# EAGLE design Joystickv05 (EAGLE 7.3.0)
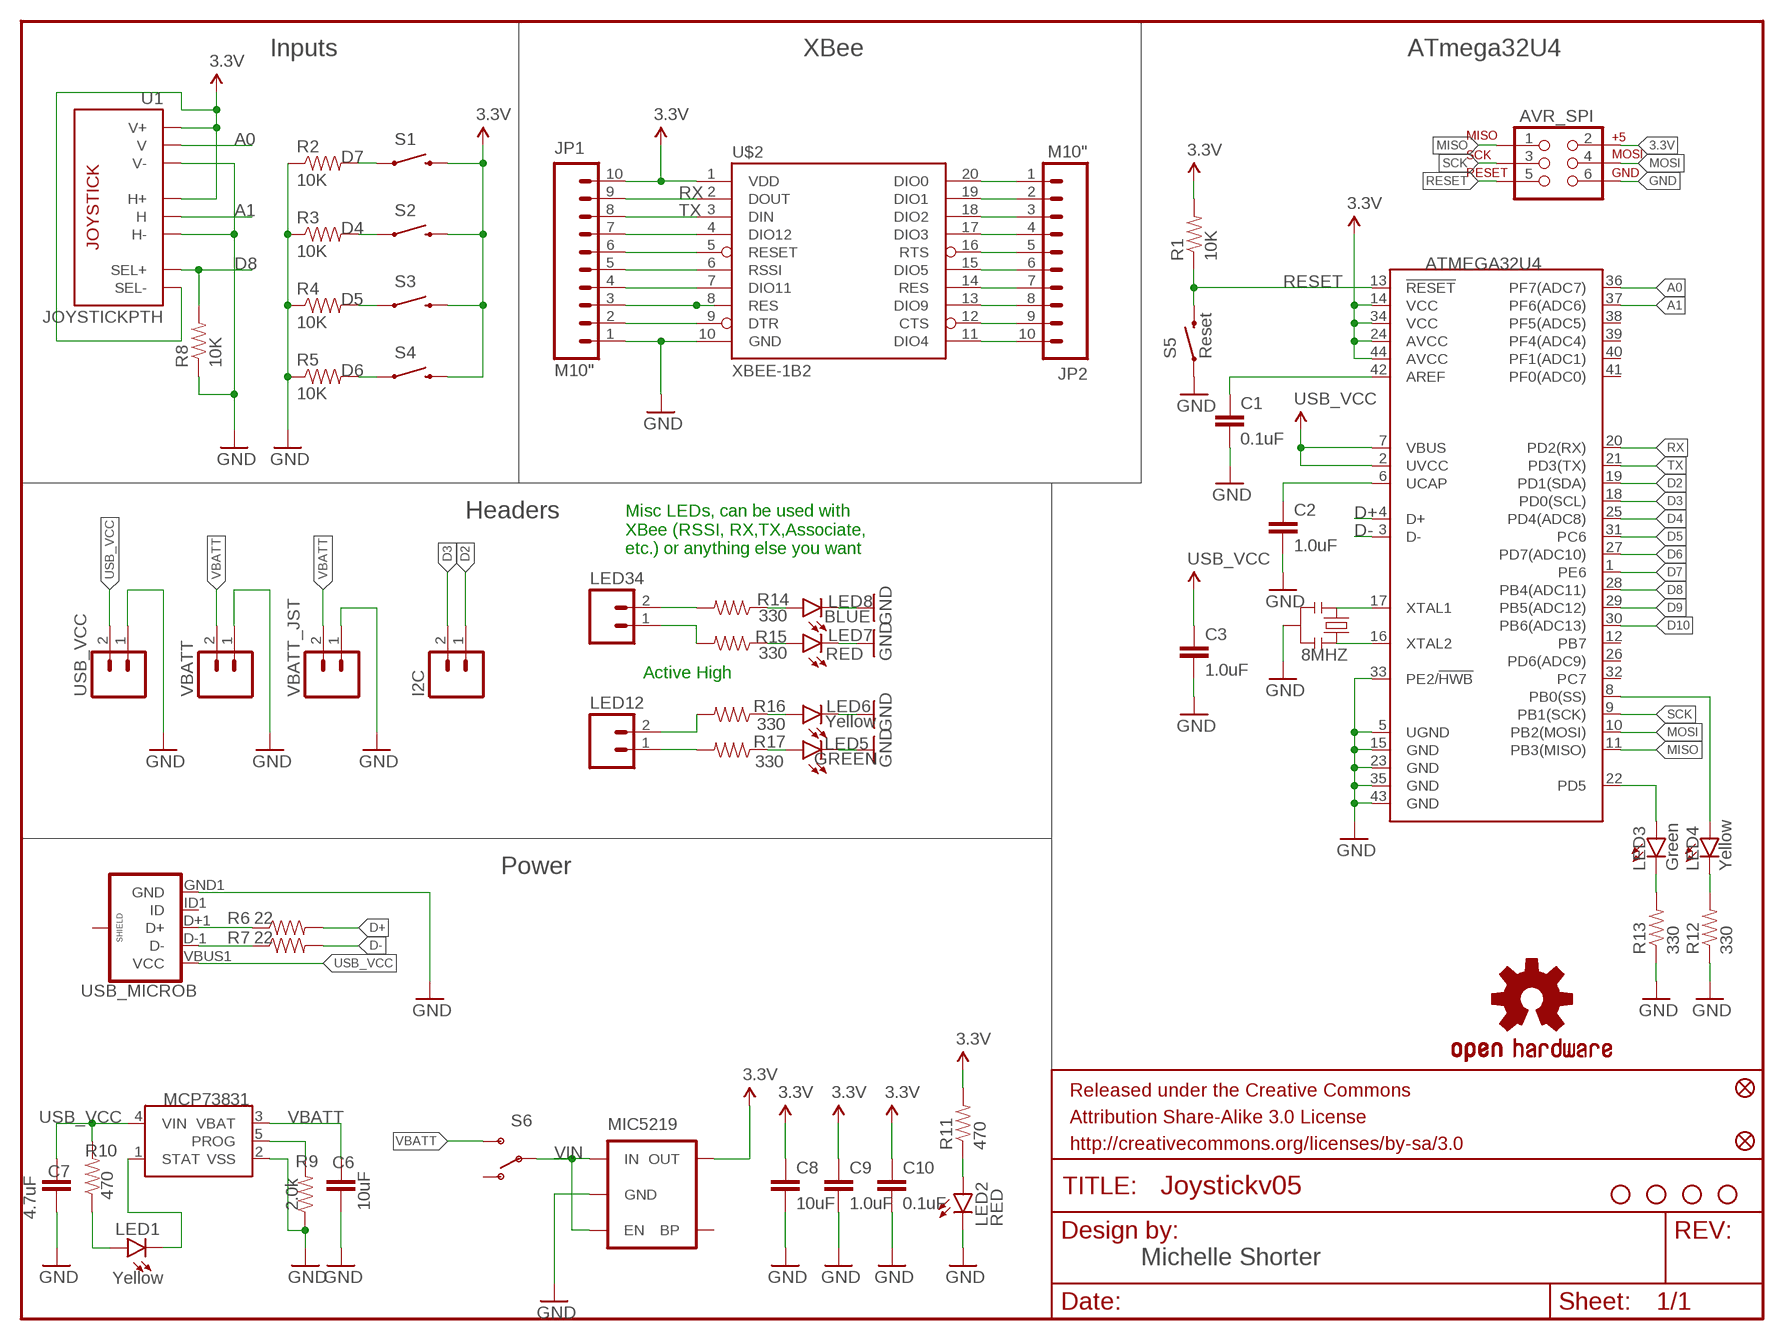
[diagram p0: schematic, sheet 1]

## Parts
ATMEGA32U4  ATMEGA32U41:1-LESS_PASTE  [QFN-44-NOPAD_1:1-LESS_PASTE]
AVR_SPI  AVR_SPI_PRG_6PTH  [2X3]
C1  0.1uF  0.1UF-25V(+80/-20%)(0603)  [0603-CAP]
C2  1.0uF  1.0UF-16V-10%(0603)  [0603-CAP]
C3  1.0uF  1.0UF-16V-10%(0603)  [0603-CAP]
C6  10uF  10UF-6.3V-20%(0603)  [0603-CAP]
C7  4.7uF  4.7UF-6.3V-10%(0603)0603  [0603-CAP]
C8  10uF  10UF-6.3V-20%(0603)  [0603-CAP]
C9  1.0uF  1.0UF-16V-10%(0603)  [0603-CAP]
C10  0.1uF  0.1UF-25V(+80/-20%)(0603)  [0603-CAP]
FID1  FIDUCIALUFIDUCIAL  [MICRO-FIDUCIAL]
FID2  FIDUCIALUFIDUCIAL  [MICRO-FIDUCIAL]
I2C  M02PTH  [1X02]
JP1  M10"  [1X10]
JP2  M10"  [1X10]
LED1  Yellow  LED-YELLOW0603  [LED-0603]
LED2  RED  LED-RED0603  [LED-0603]
LED3  Green  LED-GREEN0603  [LED-0603]
LED4  Yellow  LED-YELLOW0603  [LED-0603]
LED5  GREEN  LED-GREEN0603  [LED-0603]
LED6  Yellow  LED-YELLOW0603  [LED-0603]
LED7  RED  LED-RED0603  [LED-0603]
LED8  BLUE  LED-BLUE0603  [LED-0603]
LED12  M02PTH  [1X02]
LED34  M02PTH  [1X02]
LOGO1  OSHW-LOGOM  [OSHW-LOGO-M]
MIC5219  V_REG_MIC5219SMD  [SOT23-5]
R1  10K  10KOHM-1/10W-1%(0603)0603  [0603-RES]
R2  10K  10KOHM-1/10W-1%(0603)0603  [0603-RES]
R3  10K  10KOHM-1/10W-1%(0603)0603  [0603-RES]
R4  10K  10KOHM-1/10W-1%(0603)0603  [0603-RES]
R5  10K  10KOHM-1/10W-1%(0603)0603  [0603-RES]
R6  22  22OHM1/10W1%(0603)  [0603-RES]
R7  22  22OHM1/10W1%(0603)  [0603-RES]
R8  10K  10KOHM-1/10W-1%(0603)0603  [0603-RES]
R9  2.0k  2.0KOHM1/10W5%(0603)  [0603-RES]
R10  470  470OHM1/10W1%(0603)  [0603-RES]
R11  470  470OHM1/10W1%(0603)  [0603-RES]
R12  330  330OHM1/10W1%(0603)  [0603-RES]
R13  330  330OHM1/10W1%(0603)  [0603-RES]
R14  330  330OHM1/10W1%(0603)  [0603-RES]
R15  330  330OHM1/10W1%(0603)  [0603-RES]
R16  330  330OHM1/10W1%(0603)  [0603-RES]
R17  330  330OHM1/10W1%(0603)  [0603-RES]
S1  SWITCH-MOMENTARY-212MM  [TACTILE-PTH-12MM]
S2  SWITCH-MOMENTARY-212MM  [TACTILE-PTH-12MM]
S3  SWITCH-MOMENTARY-212MM  [TACTILE-PTH-12MM]
S4  SWITCH-MOMENTARY-212MM  [TACTILE-PTH-12MM]
S5  Reset  SWITCH-MOMENTARY-2SMD  [TACTILE-SWITCH-SMD]
S6  SWITCH-SPDTPTH  [SWITCH-SPDT]
STANDOFF1  STAND-OFF  [STAND-OFF]
STANDOFF2  STAND-OFF  [STAND-OFF]
STANDOFF3  STAND-OFF  [STAND-OFF]
STANDOFF4  STAND-OFF  [STAND-OFF]
U1  JOYSTICKPTH  [JOYSTICK]
U4  MCP73831  [SOT23-5]
U$2  XBEE-1B2  [XBEE-SILK]
U$3  8MHZ  RESONATOR8MHZ  [RESONATOR-SMD]
USB_MICROB  USB_MICROB_PLUGCONN-11752  [USB-B-MICRO-SMD_V03]
USB_VCC  M02PTH  [1X02]
VBATT  M02PTH  [1X02]
VBATT_JST  M02-JST-2MM-SMT  [JST-2-SMD]

## Nets
3.3V: ATMEGA32U4.14(VCC) ATMEGA32U4.24(AVCC) ATMEGA32U4.34(VCC) ATMEGA32U4.44(AVCC) AVR_SPI.2 C8.1 C9.1 C10.1 JP1.10 MIC5219.5(OUT) R1.2 R11.2 S1.3 S2.3 S3.3 S4.3 U1.B2A(SEL-) U1.H1(H+) U1.V1(V+) U$2.1(VDD)
A0: ATMEGA32U4.36(PF7(ADC7)) U1.V2(V)
A1: ATMEGA32U4.37(PF6(ADC6)) U1.H2(H)
D2: ATMEGA32U4.19(PD1(SDA)) I2C.1
D3: ATMEGA32U4.18(PD0(SCL)) I2C.2
D4: ATMEGA32U4.25(PD4(ADC8)) R3.2 S2.1
D5: ATMEGA32U4.31(PC6) R4.2 S3.1
D6: ATMEGA32U4.27(PD7(ADC10)) R5.2 S4.1
D7: ATMEGA32U4.1(PE6) R2.2 S1.1
D8: ATMEGA32U4.28(PB4(ADC11)) R8.2 U1.B1A(SEL+)
D9: ATMEGA32U4.29(PB5(ADC12))
D10: ATMEGA32U4.30(PB6(ADC13))
D+: ATMEGA32U4.4(D+) R6.2
D-: ATMEGA32U4.3(D-) R7.2
GND: ATMEGA32U4.5(UGND) ATMEGA32U4.15(GND) ATMEGA32U4.23(GND) ATMEGA32U4.33(PE2/!HWB) ATMEGA32U4.35(GND) ATMEGA32U4.43(GND) AVR_SPI.6 C1.2 C2.2 C3.2 C6.2 C7.2 C8.2 C9.2 C10.2 JP1.1 LED2.C LED5.C LED6.C LED7.C LED8.C MIC5219.2(GND) R2.1 R3.1 R4.1 R5.1 R8.1 R9.1 R12.1 R13.1 S5.1 U1.H3(H-) U1.V3(V-) U4.2(VSS) U$2.10(GND) U$3.2 USB_MICROB.GND1(GND) USB_VCC.1 VBATT.1 VBATT_JST.1
MISO: ATMEGA32U4.11(PB3(MISO)) AVR_SPI.1
MOSI: ATMEGA32U4.10(PB2(MOSI)) AVR_SPI.4
N$1: ATMEGA32U4.17(XTAL1) U$3.1
N$2: ATMEGA32U4.42(AREF) C1.1
N$3: R6.1 USB_MICROB.D+1(D+)
N$4: JP1.2 U$2.9(DTR)
N$5: ATMEGA32U4.6(UCAP) C2.1
N$6: ATMEGA32U4.16(XTAL2) U$3.3
N$8: JP1.3 U$2.8(RES)
N$9: R7.1 USB_MICROB.D-1(D-)
N$10: JP1.4 U$2.7(DIO11)
N$11: R9.2 U4.5(PROG)
N$12: JP1.5 U$2.6(RSSI)
N$13: JP1.6 U$2.5(RESET)
N$14: JP1.7 U$2.4(DIO12)
N$15: JP2.10 U$2.11(DIO4)
N$16: JP2.9 U$2.12(CTS)
N$17: JP2.8 U$2.13(DIO9)
N$18: JP2.7 U$2.14(RES)
N$19: JP2.6 U$2.15(DIO5)
N$20: JP2.5 U$2.16(RTS)
N$21: JP2.4 U$2.17(DIO3)
N$23: JP2.3 U$2.18(DIO2)
N$24: JP2.2 U$2.19(DIO1)
N$25: JP2.1 U$2.20(DIO0)
N$26: LED2.A R11.1
N$27: LED1.A R10.1
N$28: LED1.C U4.1(STAT)
N$29: ATMEGA32U4.8(PB0(SS)) LED4.A
N$30: LED4.C R12.2
N$31: LED3.C R13.2
N$32: ATMEGA32U4.22(PD5) LED3.A
N$33: LED12.1 R17.2
N$34: LED8.A R14.1
N$35: LED7.A R15.1
N$36: LED6.A R16.1
N$37: LED5.A R17.1
N$38: LED12.2 R16.2
N$39: LED34.1 R15.2
N$40: LED34.2 R14.2
RESET: ATMEGA32U4.13(!RESET) AVR_SPI.5 R1.1 S5.3
RX: ATMEGA32U4.20(PD2(RX)) JP1.9 U$2.2(DOUT)
SCK: ATMEGA32U4.9(PB1(SCK)) AVR_SPI.3
TX: ATMEGA32U4.21(PD3(TX)) JP1.8 U$2.3(DIN)
USB_VCC: ATMEGA32U4.2(UVCC) ATMEGA32U4.7(VBUS) C3.1 C7.1 R10.2 U4.4(VIN) USB_MICROB.VBUS1(VCC) USB_VCC.2
VBATT: C6.1 S6.3(S) U4.3(VBAT) VBATT.2 VBATT_JST.2
VIN: MIC5219.1(IN) MIC5219.3(EN) S6.2(P)
Unconnected: ATMEGA32U4.12(PB7) ATMEGA32U4.26(PD6(ADC9)) ATMEGA32U4.32(PC7) ATMEGA32U4.38(PF5(ADC5)) ATMEGA32U4.39(PF4(ADC4)) ATMEGA32U4.40(PF1(ADC1)) ATMEGA32U4.41(PF0(ADC0)) MIC5219.4(BP) S6.1(O) USB_MICROB.ID1(ID) USB_MICROB.SHIELD1(SHIELD) USB_MICROB.SHIELD2(SHIELD) USB_MICROB.SHIELD3(SHIELD)

## Notes on the sheet
- Inputs | XBee | ATmega32U4
- Headers
- Misc LEDs, can be used with
  XBee (RSSI, RX,TX,Associate,
  etc.) or anything else you want
- Active High
- Power
- Michelle Shorter

## Library data of the parts
ATMEGA32U4 = SparkFun-DigitalIC:ATMEGA32U4: Atmel 44-pin 8-bit Microcontroller with 32KBytes of ISP Flash and USB Controller
AVR_SPI = SparkFun-Connectors:AVR_SPI_PRG_6: AVR ISP 6 Pin This is the reduced ISP connector for AVR programming. Common on Arduino. This footprint will take up less PCB space and can be used with a 10-pin to 6-pin adapter such as SKU: BOB-08508
C1 C10 = SparkFun-Capacitors:0.1UF-25V(+80/-20%)(0603): CAP-00810 Ceramic Standard decoupling cap; PROD_ID: CAP-00810
C2 C3 C9 = SparkFun-Capacitors:1.0UF-16V-10%(0603): CAP-00868; PROD_ID: CAP-00868
C6 C8 = SparkFun-Capacitors:10UF-6.3V-20%(0603): CAP-11015; PROD_ID: CAP-11015
C7 = SparkFun-Capacitors:4.7UF-6.3V-10%(0603): CAP-08280; PROD_ID: CAP-08280
FID1 FID2 = SparkFun-Aesthetics:FIDUCIAL: Fiducial Alignment Points Various fiducial points for machine vision alignment.
I2C LED12 LED34 USB_VCC VBATT VBATT_JST = SparkFun-Connectors:M02: Header 2 Standard 2-pin 0.1" header. Use with straight break away headers (SKU : PRT-00116), right angle break away headers (PRT-00553), swiss pins (PRT-00743), machine pins (PRT-00117), and female headers (PRT-00115). Molex polarized connector foot print use with SKU : PRT-08233 with associated crimp pins and housings.
JP1 JP2 = SparkFun-Connectors:M10: Header 10 Standard 10-pin 0.1" header. Use with straight break away headers (SKU : PRT-00116), right angle break away headers (PRT-00553), swiss pins (PRT-00743), machine pins (PRT-00117), and female headers (PRT-00115).
LED1 LED4 LED6 = SparkFun-LED:LED-YELLOW: Yellow SMD LEDs LilyPad 1206- DIO-09909 0603- DIO-09003; PROD_ID: DIO-09003
LED2 LED7 = SparkFun-LED:LED-RED: Assorted Red LEDs LilyPad 1206- DIO-09912 1206- DIO-00809 0603- DIO-00819; PROD_ID: DIO-00819
LED3 = SparkFun-LED:LED-GREEN: Various green LEDs Green LEDs used in SFE Production 0603- DIO-00821 LARGE- DIO-00862 LILYPAD- DIO-09910; PROD_ID: DIO-00821; VALUE: GREEN
LED5 = SparkFun-LED:LED-GREEN: Various green LEDs Green LEDs used in SFE Production 0603- DIO-00821 LARGE- DIO-00862 LILYPAD- DIO-09910; PROD_ID: DIO-00821
LED8 = SparkFun-LED:LED-BLUE: Blue LEDs for production use Various blue LEDs stocked by SparkFun production 0603 - DIO-08575 Rebel - DIO-09553 1206 - DIO-09911; PROD_ID: DIO-08575
LOGO1 = SparkFun-Aesthetics:OSHW-LOGO: Open Source Hardware Logo This logo indicates the piece of hardware it is found on incorporates a OSHW license and/or adheres to the definition of open source hardware found here: http://freedomdefined.org/OSHW
MIC5219 = SparkFun-PowerIC:V_REG_MIC5219: V_REG MIC5219 Standard 500mA LDO voltage regulator in SOT-23 layout. Micrel part MIC5219. BP (by-pass) pin is used to lower output noise with 470pF cap, may be left open.
R1-R5 R8 = SparkFun-Resistors:10KOHM-1/10W-1%(0603): RES-00824; PROD_ID: RES-00824
R6 R7 = SparkFun-Resistors:22OHM1/10W1%(0603): RES-08698; PROD_ID: RES-08698
R9 = SparkFun-Resistors:2.0KOHM1/10W5%(0603): RES-08296; PROD_ID: RES-08296
R10 R11 = SparkFun-Resistors:470OHM1/10W1%(0603): RES-07869; PROD_ID: RES-07869
R12-R17 = SparkFun-Resistors:330OHM1/10W1%(0603): RES-00818; PROD_ID: RES-00818
S1-S4 = SparkFun-Electromechanical:SWITCH-MOMENTARY-2: Various NO switches- pushbuttons, reed, etc; PROD_ID: SWCH-09185
S5 = SparkFun-Electromechanical:SWITCH-MOMENTARY-2: Various NO switches- pushbuttons, reed, etc; PROD_ID: SWCH-08247
S6 = SparkFun-Electromechanical:SWITCH-SPDT: SPDT Switch Simple slide switch, Spark Fun Electronics SKU : COM-00102 DPDT SMT slide switch, AYZ0202, SWCH-08179; PROD_ID: SWCH-08261
STANDOFF1-STANDOFF4 = SparkFun-Electromechanical:STAND-OFF: #4 Stand Off This is the mechanical footprint for a #4 phillips button head screw. Use the keepout ring to avoid running the screw head into surrounding components. SKU : PRT-00447
U1 = SparkFun-Electromechanical:JOYSTICK: Thumb Joystick Joystick commonly found in PS2 controllers. Two pots and a select switch. Footprint proven. Spark Fun Electronics SKU : COM-09032
U4 = SparkFun-PowerIC:MCP73831: Miniature single cell, fully integrated Li-Ion, Li-polymer charge management controller http://ww1.microchip.com/downloads/en/DeviceDoc/21984a.pdf IC-09995; PROD_ID: IC-09995
U$2 = SparkFun-RF:XBEE-1: Xbee module footprints
U$3 = SparkFun-FreqCtrl:RESONATOR: Resonator Small SMD resonator. Used, eg, on the Arduino Pro/ Pro Mini boards. 8MHz- XTAL-08895 16MHz- XTAL-08900; PROD_ID: XTAL-08895
USB_MICROB = SparkFun-Connectors:USB_MICROB_PLUG: USB Micro-B connectors Some male, some female. Watch your step!; PROD_ID: CONN-11752

## Board
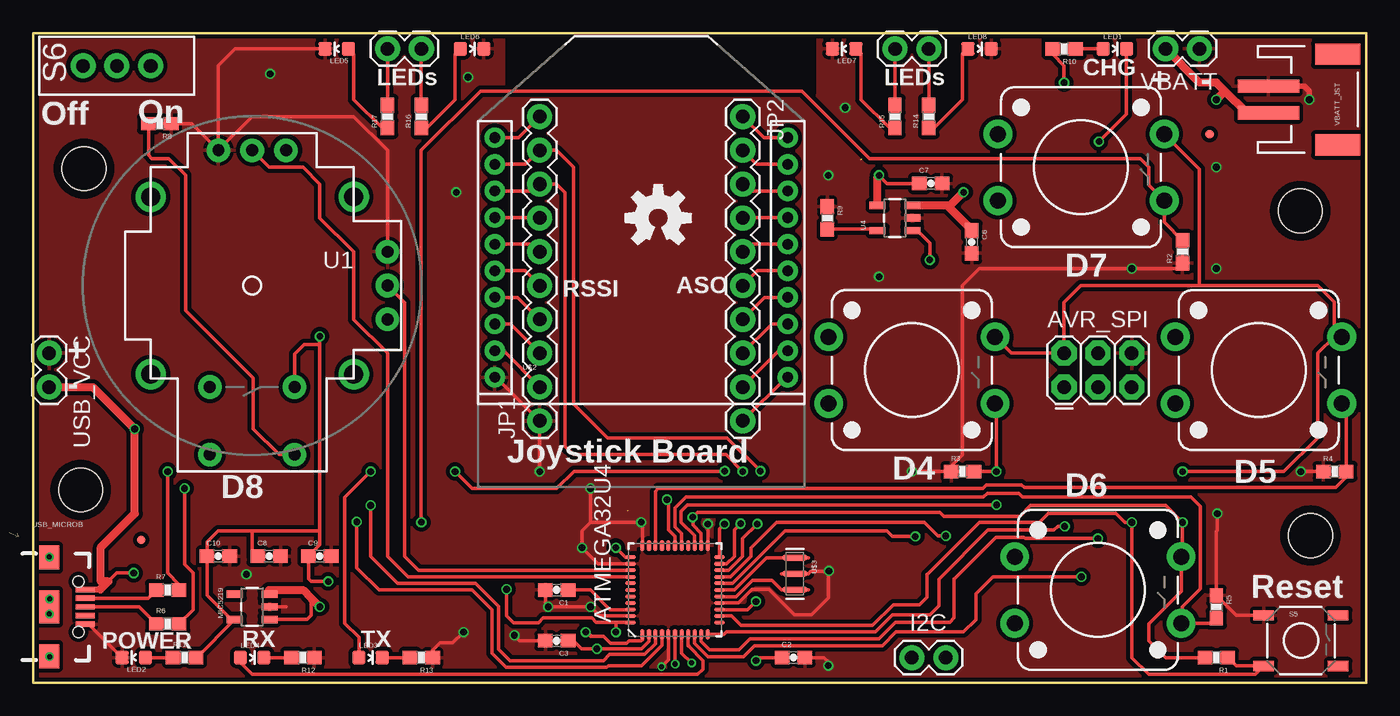
[diagram p1: board, top side]
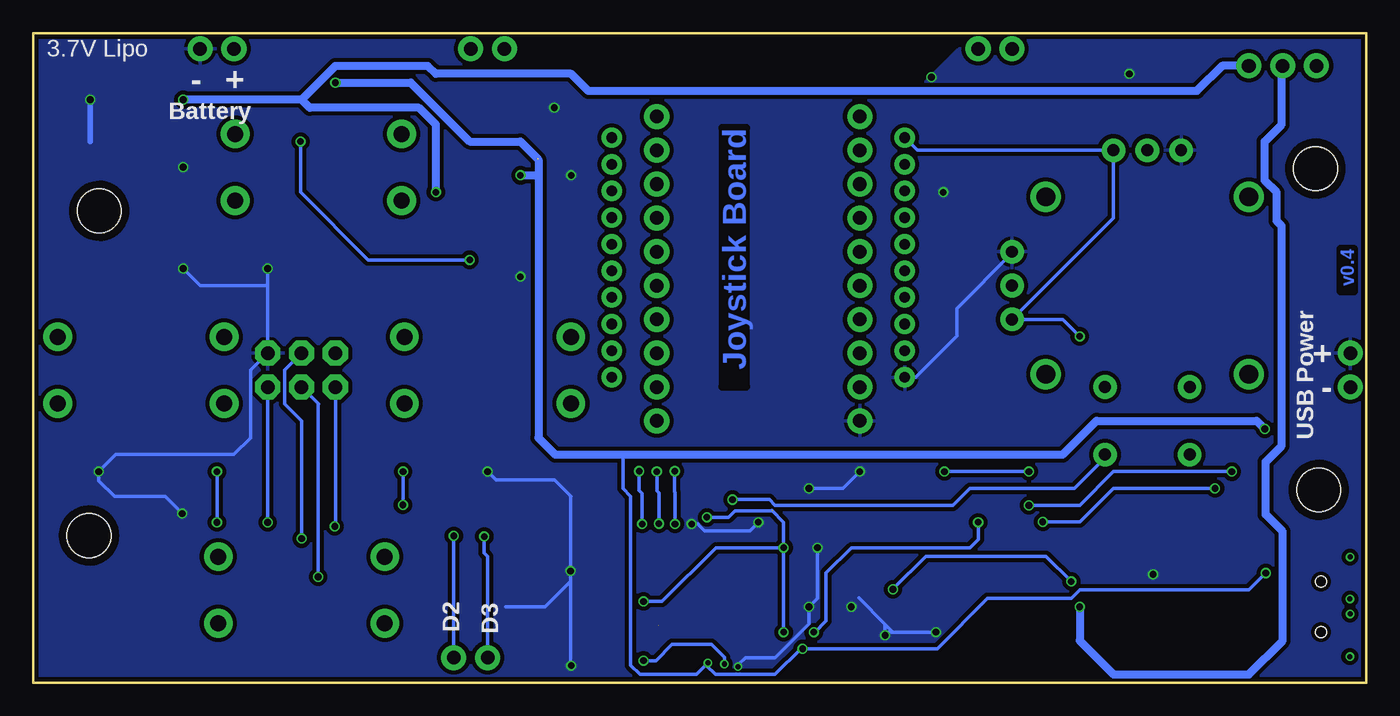
[diagram p2: board, bottom side, seen from below]

Size 100.08 x 48.77 mm. Coordinates in mm from the lower left corner, seen from the top.
Outline: 0,0 100.08,0 100.08,48.77 0,48.77 0,0
Copper layers (1*16): Top 0.035mm / dielectric 1.5mm / Bottom 0.035mm
Design rules "Gold_Phoenix_Standard_Spec_2_layer": minimum track width 5mil, minimum drill 6mil, track to track 5mil, track to pad 5mil, pad to pad 5mil, via to via 5mil, smd to smd 5mil, copper to edge 8mil, drill to drill 8mil, minimum pad ring 5mil, minimum via ring 5mil, stop-mask expansion 4mil, vias tented up to drill 20mil, thermal gap 10mil

### Footprints (pad centres in the part's own frame; a part is rotated, then mirrored left to right if it is on the bottom)
QFN-44-NOPAD_1:1-LESS_PASTE = smd 0.8 x 0.3: 1 -3.337,2.458; 2 -3.337,1.958; 3 -3.337,1.479; 4 -3.337,0.979; 5 -3.337,0.5; 6 -3.337,0; 7 -3.337,-0.5; 8 -3.337,-0.979; 9 -3.337,-1.479; 10 -3.337,-1.958; 11 -3.337,-2.458; 23 3.337,-2.458; 24 3.337,-1.958; 25 3.337,-1.479; 26 3.337,-0.979; 27 3.337,-0.5; 28 3.337,0; 29 3.337,0.5; 30 3.337,0.979; 31 3.337,1.479; 32 3.337,1.958; 33 3.337,2.458 | smd 0.3 x 0.8: 12 -2.458,-3.337; 13 -1.958,-3.337; 14 -1.479,-3.337; 15 -0.979,-3.337; 16 -0.5,-3.337; 17 0,-3.337; 18 0.5,-3.337; 19 0.979,-3.337; 20 1.479,-3.337; 21 1.958,-3.337; 22 2.458,-3.337; 34 2.458,3.337; 35 1.958,3.337; 36 1.479,3.337; 37 0.979,3.337; 38 0.5,3.337; 39 0,3.337; 40 -0.5,3.337; 41 -0.979,3.337; 42 -1.479,3.337; 43 -1.958,3.337; 44 -2.458,3.337
2X3 = drill 1.016 pad 1.88 octagon: 1 0,0; 2 0,2.54; 3 2.54,0; 4 2.54,2.54; 5 5.08,0; 6 5.08,2.54
0603-CAP = smd 1.1 x 1: 1 -0.85,0; 2 0.85,0
MICRO-FIDUCIAL = smd 0.635 x 0.635: 1 0,0
1X02 = drill 1.016 pad 1.88: 1 0,0; 2 2.54,0
1X10 = drill 1.016 pad 1.88: 1 0,0; 2 2.54,0; 3 5.08,0; 4 7.62,0; 5 10.16,0; 6 12.7,0; 7 15.24,0; 8 17.78,0; 9 20.32,0; 10 22.86,0
LED-0603 = smd 1 x 1: A 0,-0.877; C 0,0.877
SOT23-5 = smd 0.55 x 1.2: 1 -0.95,-1.3; 2 0,-1.3; 3 0.95,-1.3; 4 0.95,1.3; 5 -0.95,1.3
0603-RES = smd 1.1 x 1: 1 -0.85,0; 2 0.85,0
TACTILE-PTH-12MM = drill 1.2 pad 2.159: 1 6.25,-2.5; 2 -6.25,-2.5; 3 6.25,2.5; 4 -6.25,2.5
TACTILE-SWITCH-SMD = smd 1.524 x 0.762: 1 -2.794,1.905; 2 2.794,1.905; 3 -2.794,-1.905; 4 2.794,-1.905
SWITCH-SPDT = drill 1.016 pad 1.88: 1 0,2.54; 2 0,0; 3 0,-2.54
STAND-OFF = hole 3.302: 0,0
JOYSTICK = drill 0.9 pad 1.778: B1A -3.175,12.7; B1B 3.175,12.7; B2A -3.175,7.62; B2B 3.175,7.62 | drill 0.889 pad 1.778: H1 -2.54,-10.16; H2 0,-10.16; H3 2.54,-10.16; V1 -10.16,2.54; V2 -10.16,0; V3 -10.16,-2.54 | drill 1.397 pad 2.286: MOUNT1 -7.62,6.668; MOUNT2 -7.62,-6.668; MOUNT3 7.62,-6.668; MOUNT4 7.62,6.668
XBEE-SILK = drill 0.8 pad 1.524: 1 -11,20; 2 -11,18; 3 -11,16; 4 -11,14; 5 -11,12; 6 -11,10; 7 -11,8; 8 -11,6; 9 -11,4; 10 -11,2; 11 11,2; 12 11,4; 13 11,6; 14 11,8; 15 11,10; 16 11,12; 17 11,14; 18 11,16; 19 11,18; 20 11,20
RESONATOR-SMD = smd 0.45 x 1.905: 1 -1.2,0; 2 0,0; 3 1.2,0
USB-B-MICRO-SMD_V03 = smd 1.4 x 0.4: D+1 2.7,0; D-1 2.7,0.65; GND1 2.7,-1.3; ID1 2.7,-0.65; VBUS1 2.7,1.3 | smd 1.5 x 1.8: SHIELD1 0,3.7; SHIELD2 0,-3.7 | smd 1.5 x 2.5: SHIELD3 0,0 | hole 0.85: 2.2,1.9; 2.2,-1.9
JST-2-SMD = smd 1 x 4.6: 1 -1,-3.7; 2 1,-3.7 | smd 1.6 x 3.4: NC1 -3.4,1.5; NC2 3.4,1.5

### Placement (x,y rotation side)
ATMEGA32U4  48.18,6.96 90 top
AVR_SPI  77.39,22.2 0 top
C1  39.29,6.96 180 top
C2  57.07,1.88 0 top
C3  39.29,3.15 180 top
C6  70.46,33.1 270 top
C7  67.39,37.49 0 top
C8  17.7,9.5 0 top
C9  21.51,9.5 0 top
C10  13.89,9.5 0 top
FID1  8.1,10.72 0 top
FID2  88.32,41.2 0 top
I2C  68.5,1.88 180 top
JP1  38.02,19.66 90 top
JP2  53.26,42.52 270 top
LED1  81.2,47.6 270 top
LED2  7.54,1.88 90 top
LED3  25.32,1.88 270 top
LED4  16.43,1.88 270 top
LED5  22.78,47.6 90 top
LED6  32.94,47.6 270 top
LED7  60.88,47.6 90 top
LED8  71.04,47.6 270 top
LED12  26.59,47.6 0 top
LED34  64.69,47.6 0 top
LOGO1  46.91,34.9 0 top
MIC5219  16.43,5.69 90 top
R1  88.82,1.88 180 top
R2  86.28,32.36 90 top
R3  69.77,15.85 0 top
R4  97.71,15.85 0 top
R5  88.82,5.69 270 top
R6  10.08,4.42 0 top
R7  10.08,6.96 0 top
R8  9.5,41.99 180 top
R9  59.61,34.9 270 top
R10  77.39,47.6 180 top
R11  11.35,1.88 0 top
R12  20.24,1.88 180 top
R13  29.13,1.88 180 top
R14  67.23,42.52 90 top
R15  64.69,42.52 90 top
R16  29.13,42.52 90 top
R17  26.59,42.52 90 top
S1  78.66,38.71 0 top
S2  65.96,23.47 0 top
S3  92,23.47 0 top
S4  79.93,6.96 0 top
S5  95.17,3.15 0 top
S6  6.27,46.33 90 top
STANDOFF1  3.81,38.61 0 top
STANDOFF2  3.56,14.48 0 top
STANDOFF3  95.89,11.05 0 top
STANDOFF4  95.12,35.43 0 top
U1  16.43,29.82 180 top
U4  64.69,34.9 90 top
U$2  45.64,20.93 0 top
U$3  57.18,8.18 270 top
USB_MICROB  1.19,5.69 0 top
USB_VCC  1.19,24.74 270 top
VBATT  87.55,47.6 180 top
VBATT_JST  96.44,43.79 270 top

### Tracks (layer width: path | path; a pad name or v marks a point on that pad's centre or on a via)
3.3V  (via drill 0.5, 0.51)  (1 unrouted)
  Top 0.254: ATMEGA32U4.14 53.64,5.48 v54.25,6.1 | 44.76,4.55 44.7,4.55 | 44.7,4.55 43.69,4.55 | 43.69,4.55 42.27,4.55 41.96,4.85 38.29,4.85 37.93,4.49 36.08,4.49 35.53,5.03 v35.53,7.01 | v22.15,7.59 20.88,7.59 20.66,7.81 C9.1 21.51,10.35 21.51,11.4 | S2.3 73.44,24.74 AVR_SPI.2 77.39,28.55 78.66,29.82 87.55,29.82 | v86.28,15.85 93.9,15.85 96.44,18.39 96.44,24.74 97.67,25.97 | R1.2 85.01,1.88 83.74,3.15 83.74,4.42 86.18,6.86 S4.3 86.22,9.5 86.28,9.5 v86.28,12.04 v86.27,12.04 85.01,13.3 74.87,13.3 74.07,12.5 68.35,12.5 68.07,12.78 49.86,12.78 v49.51,12.42 49.53,12.39 49.53,11.84 50.14,11.22 ATMEGA32U4.24 | R11.2 12.27,1.88 MIC5219.5 14.84,4.74 13.04,6.54 C10.1 13.04,10.55 13.89,11.4 16.43,11.4 | U$2.1 36.43,40.93 JP1.10 | v21.51,26.01 21.51,25.4 | 21.51,25.4 21.51,11.4 | 87.55,29.82 96.44,29.82 97.67,28.59 97.67,25.97 | 87.55,29.82 87.55,38.57 S1.3 | 16.43,11.4 21.51,11.4 | C8.1 16.43,9.5 16.43,11.4 | 44.46,4.5 ATMEGA32U4.44 44.75,4.5 44.7,4.55 | ATMEGA32U4.34 44.46,9.42 v43.74,10.13 | S3.3 97.67,25.97 | U1.B2A 19.61,24.69 20.32,25.4 21.51,25.4 | S1.3 | v43.74,3.79 43.74,4.5 43.69,4.55
  Bottom 0.254: v22.15,7.59 24.05,9.5 33.07,9.5 35.53,7.04 v35.53,7.01 | v86.28,12.04 v86.28,15.85 | U$2.1 33.69,39.98 U1.H1 18.97,34.9 U1.V1 22.78,27.28 v21.51,26.01 | v43.74,3.79 v43.74,10.13 | v49.51,12.42 47.88,12.42 47.4,12.9 44.63,12.9 44.6,12.88 | 44.63,12.93 43.74,12.04 v43.74,10.13 | v43.74,10.13 48.82,10.13 52.86,6.1 v54.25,6.1
A0
  Top 0.254: ATMEGA32U4.36 28.93,8.44 27.86,9.5 27.86,28.55 U1.V2
A1
  Top 0.254: ATMEGA32U4.37 28.16,7.94 26.59,9.5 26.59,24.74 24.05,27.28 24.05,32.36 21.51,34.9 21.51,37.44 20.24,38.71 17.7,38.71 U1.H2
D2  (via drill 0.5)
  Top 0.254: ATMEGA32U4.19 52.34,7.94 53.9,9.5 53.9,10.13 55.8,12.04 66.9,12.04 67.92,11.02 v68.5,11.02
  Bottom 0.254: v68.5,11.02 I2C.1
D3  (via drill 0.5)
  Top 0.254: ATMEGA32U4.18 52.49,7.46 56.44,11.4 64.08,11.4 64.52,10.97 v66.22,10.97
  Bottom 0.254: v66.22,10.97 66.22,9.75 65.96,9.5 I2C.2
D4  (via drill 0.5, 0.51)
  Top 0.254: R3.2 v72.31,15.85 72.31,20.85 72.21,20.95 S2.1 | ATMEGA32U4.25 49.66,11.04 49.64,11.04 48.65,12.04 48.65,12.86 49.12,13.34 72.31,13.34 v72.33,13.35
  Bottom 0.254: v72.31,15.85 72.31,13.36 v72.33,13.35
D5
  Top 0.254: ATMEGA32U4.31 46.7,14.37 46.91,14.58 71.3,14.58 71.58,14.86 74.19,14.86 74.4,14.66 97.79,14.66 98.56,15.43 R4.2 98.56,20.65 S3.1
D6
  Top 0.254: ATMEGA32U4.27 48.68,11.2 48.17,11.71 48.17,13.12 49,13.95 71.35,13.95 71.63,14.22 73.99,14.22 74.27,13.95 86.92,13.95 87.62,13.25 87.62,7.05 87.63,7.04 86.28,5.69 86.28,4.56 S4.1 88.44,4.46 R5.2
D7  (via drill 0.5)
  Top 0.254: ATMEGA32U4.1 45.73,3.23 45.64,3.15 44.73,3.15 44.53,2.95 43.36,2.95 42.82,3.48 41.91,3.48 | v29.13,12.04 29.13,39.98 33.58,44.42 57.71,44.42 62.79,39.34 83.11,39.34 83.74,38.71 83.74,37.38 S1.1 84.91,34.58 R2.2 | 41.91,3.48 41.83,3.48 | v41.48,3.79 41.6,3.79 41.91,3.48
  Bottom 0.254: v29.13,12.04 29.13,10.77 29.77,10.13 38.66,10.13 40.56,8.23 40.56,4.62 41.4,3.79 v41.48,3.79
D8  (via drill 0.5)
  Top 0.254: ATMEGA32U4.28 48.18,10.97 47.7,11.46 47.7,13.49 47.73,13.51 47.57,13.66 v47.57,13.74 | U1.B1A 18.44,17.12 16.51,19.05 16.51,22.86 11.43,27.94 11.43,38.1 10.16,39.37 8.89,39.37 8.65,39.61 R8.2
  Bottom 0.254: v47.57,13.74 44.81,13.74 44.37,13.31 31.04,13.31 29.77,14.58 21.89,14.58 19.61,16.87 U1.B1A
D+  (via drill 0.5, 0.51)
  Top 0.254: ATMEGA32U4.4 47.2,2.81 45.67,1.27 43.18,1.27 43.05,1.14 35.51,1.14 34.44,2.21 34.44,5.46 32.94,6.96 25.96,6.96 24.28,8.64 v24.28,12.06 | v11.35,14.58 11.35,8.87 11.99,8.23 11.99,5.47 R6.2
  Bottom 0.254: v24.28,12.06 21.49,12.06 18.97,14.58 v11.35,14.58
D-  (via drill 0.5, 0.51)
  Top 0.254: ATMEGA32U4.3 46.7,2.92 45.9,2.11 43.26,2.11 42.8,1.65 35.81,1.65 34.95,2.52 34.95,5.71 33.21,7.46 27.37,7.46 25.32,9.5 v25.32,13.31 | R7.2 10.93,7.38 10.08,8.23 v10.08,15.85
  Bottom 0.254: v25.32,13.31 21.51,13.31 18.97,15.85 v10.08,15.85
GND  (via drill 0.38, 0.5, 0.51)
  Top 0.254: ATMEGA32U4.43 42.52,5 v41.83,5.69 v38.66,5.69 38.44,5.91 C1.2 | ATMEGA32U4.15 52.95,5.98 53.98,7.01 55.22,7.01 57.15,5.08 58.42,5.08 59.69,6.35 59.69,8.34 58.36,8.34 58.19,8.18 | ATMEGA32U4.5 47.68,1.71 v47.17,1.19 | C2.2 59.36,1.88 59.69,1.55 v59.69,1.27 | R4.1 v95.17,15.85 | 92.63,5.31 S5.1 90.31,5.05 R5.1 88.82,11.35 88.9,11.43 v88.9,12.7 | LED2.C 4.16,4.39 USB_MICROB.GND1 | U$2.10 34.75,22.93 JP1.1 v38.02,15.85 | MIC5219.2 18.97,5.69 | 41.83,12.04 v45.64,12.04 45.73,11.96 ATMEGA32U4.33 | 41.83,12.04 41.2,11.4 v41.2,10.13 42.42,8.92 ATMEGA32U4.35 | 41.83,12.04 v41.83,14.58 | v65.96,15.85 R3.1 68.92,16.25 68.92,16.26 69.77,17.11 69.77,29.82 71.04,31.09 v82.47,31.09 85.85,31.09 R2.1 | v32.31,3.79 31.5,2.97 30.53,2.97 29.98,2.42 R13.1 | LED5.C 15.16,47.6 13.89,46.33 U1.H3 | U1.H3 16.43,42.52 24.05,42.52 26.59,39.98 U1.V3 | C3.2 36.52,3.15 v36.12,3.56 | ATMEGA32U4.23 v50.64,11.91 v50.65,11.91 | R8.1 11.89,41.99 U1.H3
  Top 0.406: VBATT_JST.1 95.44,44.79 95.81,44.42 v95.81,43.79
  Bottom 0.254: v41.2,10.13 41.2,6.33 v41.83,5.69 41.83,4.42 44.37,1.88 46.61,1.88 47.17,1.32 v47.17,1.19 | v41.83,14.58 39.29,14.58 v38.02,15.85 | v50.65,11.91 50.18,11.91 50.18,11.9 49.68,11.4 46.28,11.4 v45.64,12.04 | v65.96,15.85 65.33,15.21 60.94,15.21 59.69,13.97 59.74,13.92 v59.74,8.38 59.74,7.62 | v32.31,3.79 35.89,3.79 v36.12,3.56 36.12,4.37 | 82.47,29.82 AVR_SPI.6 83.74,23.47 83.74,18.39 85.01,17.12 93.9,17.12 v95.17,15.85 95.17,15.16 93.98,13.97 90.17,13.97 v88.9,12.7 | 82.47,29.82 v82.47,31.09 | v88.82,31.09 87.55,29.82 82.47,29.82 | 59.74,7.62 59.74,1.32 v59.69,1.27 | 64.63,5.69 61.67,5.69 59.74,7.62 | U$2.10 33.84,22.93 30.73,26.04 30.73,28.11 26.59,32.25 U1.V3 | 36.12,4.37 38.1,6.35 | 36.12,4.37 35.56,3.81
  Bottom 0.406: v95.81,43.79 95.81,40.62
  other vias: 88.82,38.71 63.5,30.48 59.69,38.1 31.75,36.83 17.78,45.72 16,8.13 32.64,45.47 60.96,43.18
  pour Top (isolate 0.305): 0,0 100.08,0 100.08,48.77 58.93,48.77 58.93,44.2 58.67,43.94 35.31,43.94 35.31,48.77 0,48.77
  pour Bottom (isolate 0.305): 0,0 100.08,0 100.08,48.77 63.25,48.77 58.42,43.94 34.29,43.94 29.36,48.77 0,48.77
MISO  (via drill 0.5)
  Top 0.254: ATMEGA32U4.11 51.86,3.62 52.05,3.81 63.25,3.81 64.52,5.08 67.31,5.08 68,5.77 68,7.77 71.68,11.46 76.63,11.46 76.91,11.73 v77.44,11.73
  Bottom 0.254: 77.41,11.84 77.44,11.8 v77.44,11.73 77.39,11.79 AVR_SPI.1
MOSI  (via drill 0.51)
  Top 0.254: ATMEGA32U4.10 50.14,3.1 50.77,2.46 52.98,2.46 53.82,3.3 63.49,3.3 64.73,4.55 68.81,4.55 69.14,4.88 69.14,7.79 69.15,7.79 72.28,10.91 74.38,10.91 74.47,10.82 v79.93,10.82
  Bottom 0.254: v79.93,10.82 79.93,19.66 81.2,20.93 81.2,23.47 AVR_SPI.4
N$1
  Top 0.254: ATMEGA32U4.17 52.64,6.96 55.06,9.38 56.16,9.38
N$2
  Top 0.254: ATMEGA32U4.42 43.31,5.48 41.83,6.96 C1.1
N$3
  Top 0.254: USB_MICROB.D+1 7.96,5.69 R6.1
N$4
  Top 0.254: U$2.9 35.29,24.93 JP1.2
N$5  (via drill 0.38, 0.5)
  Top 0.254: ATMEGA32U4.6 v48.18,1.4 48.18,1.8 | v54.25,1.65 54.3,1.65 54.53,1.88 C2.1
  Bottom 0.254: v54.25,1.65 53.34,1.65 52.12,2.87 49.15,2.87 48.18,1.91 v48.18,1.4
N$6
  Top 0.254: ATMEGA32U4.16 52.76,6.46 53.99,7.68 55.45,7.68 56.16,6.98
N$7  (via drill 0.38)
  other vias: 1.22,6.29
N$8
  Top 0.254: U$2.8 35.83,26.93 JP1.3
N$9
  Top 0.254: USB_MICROB.D-1 8.61,6.34 R7.1
N$10
  Top 0.254: U$2.7 36.37,28.93 JP1.4
N$11
  Top 0.254: R9.2 63.29,34.05 U4.5
N$12
  Top 0.254: U$2.6 36.91,30.93 JP1.5
N$13
  Top 0.254: U$2.5 37.45,32.93 JP1.6
N$14
  Top 0.254: U$2.4 37.99,34.93 JP1.7
N$15
  Top 0.254: U$2.11 56.53,22.93 JP2.10
N$16
  Top 0.254: U$2.12 55.99,24.93 JP2.9
N$17
  Top 0.254: U$2.13 55.45,26.93 JP2.8
N$18
  Top 0.254: U$2.14 54.91,28.93 JP2.7
N$19
  Top 0.254: U$2.15 54.37,30.93 JP2.6
N$20
  Top 0.254: U$2.16 53.83,32.93 JP2.5
N$21
  Top 0.254: U$2.17 53.29,34.93 JP2.4
N$22  (via drill 0.38)
  other vias: 1.21,5.16
N$23
  Top 0.254: U$2.18 53.77,36.93 JP2.3
N$24
  Top 0.254: U$2.19 54.31,38.93 JP2.2
N$25
  Top 0.254: U$2.20 54.85,40.93 JP2.1
N$26
  Top 0.254: LED2.A R11.1
N$27
  Top 0.254: R10.1 LED1.A
N$28  (via drill 0.5)
  Top 0.254: LED1.C 82.08,42.71 v80.01,40.64 | v67.31,31.75 67.31,33.02 66.38,33.95 U4.1
  Bottom 0.254: v80.01,40.64 80.01,36.83 74.93,31.75 v67.31,31.75
N$29
  Top 0.254: ATMEGA32U4.8 49.16,2.78 49.21,2.78 49.21,2.73 50.29,1.65 50.29,1.02 49.89,0.61 16.43,0.61 15.56,1.49 LED4.A
N$30
  Top 0.254: LED4.C R12.2
N$31
  Top 0.254: R13.2 LED3.C
N$32  (via drill 0.5, 0.51)
  Top 0.254: ATMEGA32U4.22 51.52,11.54 v51.89,11.91 | v51.92,15.88 40.59,15.88 39.29,14.58 32.94,14.58 v31.67,15.85 | v25.32,15.85 23.38,13.91 23.38,4.46 24.45,3.39 LED3.A
  Bottom 0.254: v51.92,15.88 51.92,14.33 51.89,14.3 v51.89,11.91 | v31.67,15.85 v25.32,15.85
N$33
  Top 0.254: R17.2 LED12.1
N$34
  Top 0.254: R14.1 67.65,41.67 69.77,43.79 69.77,47.21 LED8.A
N$35
  Top 0.254: R15.1 64.27,41.67 62.15,43.79 62.15,47.21 LED7.A
N$36
  Top 0.254: R16.1 29.55,41.67 31.67,43.79 31.67,47.21 LED6.A
N$37
  Top 0.254: R17.1 26.17,41.67 24.05,43.79 24.05,47.21 LED5.A
N$38
  Top 0.254: R16.2 LED12.2
N$39
  Top 0.254: R15.2 LED34.1
N$40
  Top 0.254: R14.2 LED34.2
N$41  (via drill 0.38)
  other vias: 1.21,9.44
N$42  (via drill 0.38)
  other vias: 1.23,1.94
RESET  (via drill 0.51)  (1 unrouted)
  Top 0.254: ATMEGA32U4.13 52.42,5 53.13,4.29 | 53.14,4.29 63.02,4.29 64.57,5.84 66.55,5.84 67.11,6.4 67.11,8.12 67.12,8.12 71.04,12.04 75.54,12.04 76.2,12.7 81.28,12.7 81.94,12.04 v82.47,12.04 | R1.1 90.31,1.25 S5.3 91.75,0.61 83.74,0.61 82.47,1.88 v82.47,12.04 | v82.47,12.04 82.45,12.04
  Bottom 0.254: v82.47,12.04 AVR_SPI.5
RX  (via drill 0.5, 0.51)
  Top 0.254: ATMEGA32U4.20 52.2,8.44 53.26,9.5 53.26,10.82 v54.36,11.91 | U$2.2 36.97,38.93 JP1.9 39.29,39.98 40.56,38.71 40.56,20.93 43.1,18.39 52.08,18.39 v54.59,15.89 v54.59,15.88
  Bottom 0.254: v54.36,11.91 54.36,14.22 54.59,14.45 v54.59,15.88
SCK  (via drill 0.51)
  Top 0.254: ATMEGA32U4.9 49.66,2.97 50.67,1.96 53.31,1.96 54.14,2.78 63.74,2.78 64.77,3.81 69.85,3.81 70.76,4.72 70.76,6.68 72.03,7.95 v78.69,7.95
  Bottom 0.254: AVR_SPI.3 78.66,20.93 78.69,20.9 v78.69,7.95
TX  (via drill 0.5, 0.51)
  Top 0.254: ATMEGA32U4.21 52.05,8.92 52.63,9.5 52.63,11.46 v53.11,11.94 | v53.26,15.85 51.99,17.12 40.56,17.12 39.93,17.75 39.93,36.8 39.29,37.44 JP1.8 37.51,36.93 U$2.3
  Bottom 0.254: v53.26,15.85 53.26,14.4 53.11,14.25 v53.11,11.94
USB_VCC  (via drill 0.38, 0.5, 0.51)  (1 unrouted)
  Top 0.254: ATMEGA32U4.2 46.23,3.1 45.67,2.54 v42.32,2.54 41.17,2.54 40.56,3.15 C3.1 | ATMEGA32U4.7 48.68,2.22 v49.43,1.47 | R10.2 76.54,47.18 77.39,46.33 v77.39,45.06 | v7.54,8.23 6.27,8.23 5.64,7.59 | C7.1 64.11,37.49 v63.5,38.1
  Top 0.457: USB_MICROB.VBUS1 5.03,6.99
  Top 0.61: 5.03,6.99 5.64,7.59 5.08,7.59 5.08,10.16 7.62,12.7 v7.62,19.05 4.47,22.2 USB_VCC.2 | U4.4 63.39,37.99 v63.5,38.1
  Bottom 0.254: v7.54,8.23 8.81,6.96 21.51,6.96 22.15,6.33 28.42,6.33 32.21,2.54 v42.32,2.54 42.44,2.54 44.37,0.61 48.87,0.61 49.53,1.27 | 55.8,17.12 55.8,14.58 55.22,13.99 55.22,1.29 54.53,0.61 50.29,0.61 v49.43,1.47
  Bottom 0.61: v77.39,45.06 71.73,45.06 67.31,40.64 63.5,40.64 62.23,39.37 | 62.15,39.29 62.15,38.1 | 62.15,38.1 62.15,18.39 60.88,17.12 55.8,17.12 22.78,17.12 20.24,19.66 8.23,19.66 v7.62,19.05 | v63.5,38.1 62.15,38.1
VBATT  (via drill 0.5, 0.51)
  Top 0.406: VBATT_JST.2 91.09,42.79
  Top 0.61: 91.09,42.79 89.46,44.42 | 89.46,44.42 88.82,45.06 87.55,45.06 VBATT.2 | v88.82,43.79 89.46,44.42 | U4.3 68.58,35.85 | 68.58,35.85 68.87,35.85 v69.85,36.83 | C6.1 70.46,33.97 68.58,35.85
  Bottom 0.61: 79.93,43.79 77.39,46.33 70.46,46.33 69.85,45.72 59.69,45.72 58.42,44.45 12.7,44.45 10.82,46.33 S6.3 | 79.93,43.79 v88.82,43.79 | v69.85,36.83 69.85,41.91 71.12,43.18 79.32,43.18 79.93,43.79
VIN  (via drill 0.5)
  Top 0.254: MIC5219.3 17.73,6.93 17.7,6.96 | 20.88,6.33 20.88,5.05 20.56,4.74 MIC5219.1
  Top 0.61: 17.7,6.96 20.24,6.96 20.88,6.33 v21.51,5.69
  Bottom 0.254: 6.35,46.33 S6.2
  Bottom 0.61: v21.51,5.69 21.51,3.15 18.97,0.61 8.81,0.61 6.27,3.15 6.27,11.35 7.54,12.62 7.54,16.59 6.35,17.78 6.35,34.29 6.73,34.67 6.73,36.83 7.62,37.72 7.62,40.64 6.35,41.91 6.35,46.33

### Text on the board
Bottom: Joystick Board | v0.4
tPlace: CHG | LEDs | LEDs | On | + | - | Off | D7 | RSSI | ASO | + | - | Joystick Board | D4 | D5 | D8 | D6 | Reset | POWER | RX | TX
bPlace: 3.7V Lipo | + | - | Battery | USB Power | + | - | D3 | D2